# Altium schematic sheet Sheet1.SchDoc
size A; SheetNumber: 1; SheetTotal: 1
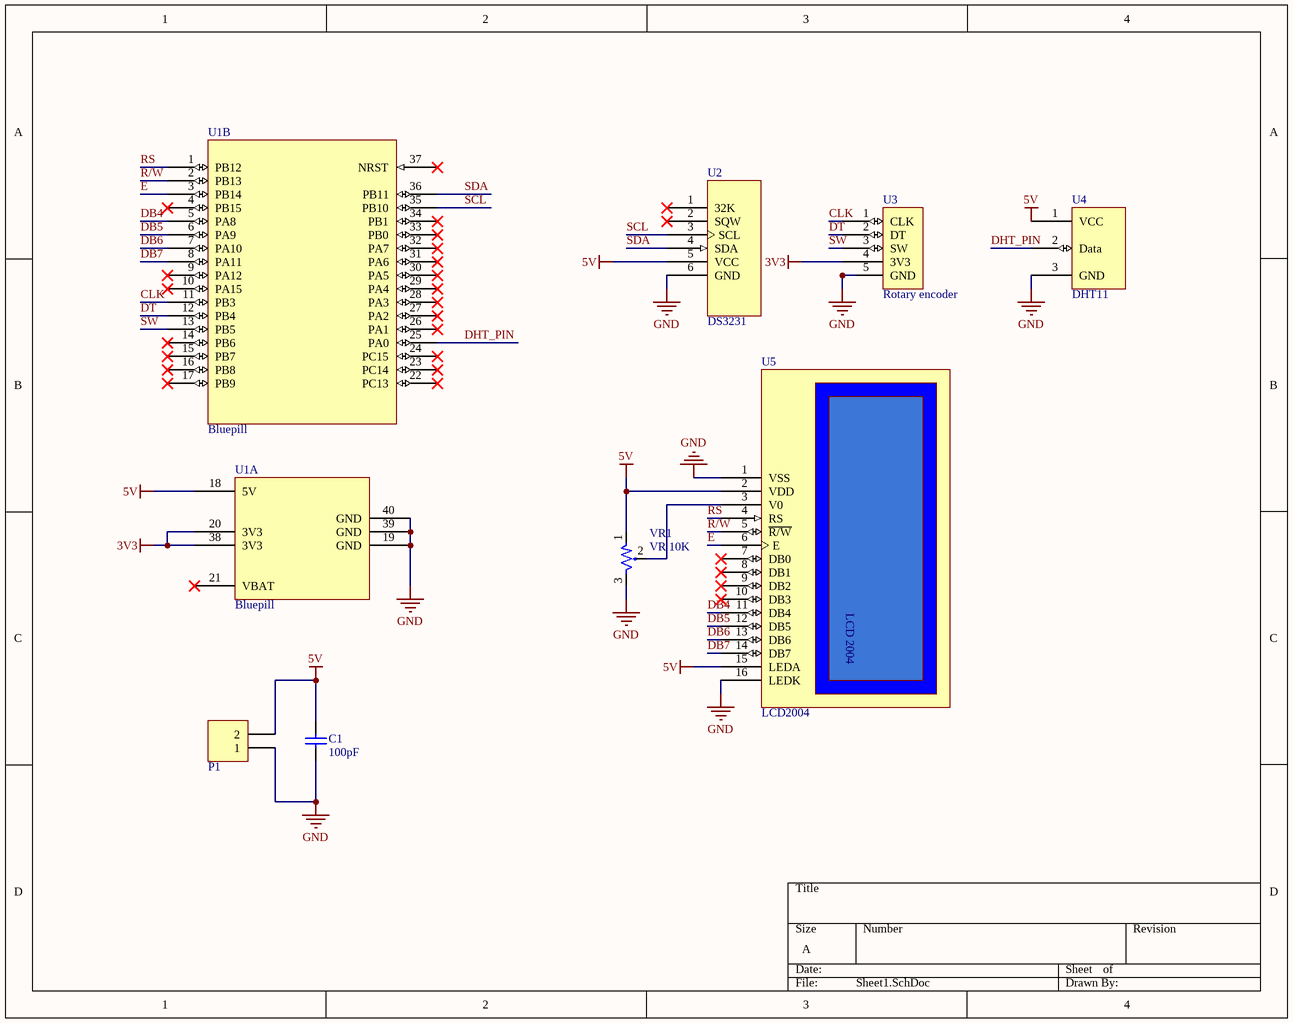
[diagram p0: Sheet1.SchDoc]

## Parts
C1  value 100pF  [CN1]  (hidden comment: Cap Non-Pol)
P1  Domino 2  [DOMINO 2- 5mm]  (value not drawn)
U1  Bluepill  [PCBComponent_1]  (parts A,B of 2)
U2  DS3231  [DS3231]
U3  Rotary encoder  [Rotary Encoder]
U4  DHT11  [DH11]
U5  LCD2004  [LCD2004]
VR1  value VR 10K  [Varistor 1]  (hidden comment: 10K)

## Nets
3V3: U1.20(3V3) U1.38(3V3) U3.4(3V3)
5V: C1.2 P1.2 U1.18(5V) U2.5(VCC) U4.1(VCC) U5.2(VDD) U5.15(LEDA) VR1.1
GND: C1.1 P1.1 U1.19(GND) U1.39(GND) U1.40(GND) U2.6(GND) U3.5(GND) U4.3(GND) U5.1(VSS) U5.16(LEDK) VR1.3
CLK: U1.11(PB3) U3.1(CLK)
DB4: U1.5(PA8) U5.11(DB4)
DB5: U1.6(PA9) U5.12(DB5)
DB6: U1.7(PA10) U5.13(DB6)
DB7: U1.8(PA11) U5.14(DB7)
DHT_PIN: U1.25(PA0) U4.2(Data)
DT: U1.12(PB4) U3.2(DT)
E: U1.3(PB14) U5.6(E)
R/W: U1.2(PB13) U5.5(~{R/W})
RS: U1.1(PB12) U5.4(RS)
SCL: U1.35(PB10) U2.3(SCL)
SDA: U1.36(PB11) U2.4(SDA)
SW: U1.13(PB5) U3.3(SW)
NetU5_3: U5.3(V0) VR1.2

Not connected (* = marked no-connect by the designer): U1 4(PB15)* 9(PA12)* 10(PA15)* 14(PB6)* 15(PB7)* 16(PB8)* 17(PB9)* 21(VBAT)* 22(PC13)* 23(PC14)* 24(PC15)* 26(PA1)* 27(PA2)* 28(PA3)* 29(PA4)* 30(PA5)* 31(PA6)* 32(PA7)* 33(PB0)* 34(PB1)* 37(NRST)*; U2 1(32K)* 2(SQW)*; U5 7(DB0)* 8(DB1)* 9(DB2)* 10(DB3)*

## Notes on the sheet
- (in symbol LCD2004) LCD 2004

## Library data of the parts
C1 = Cap Non-Pol: Capacitor
P1 = Domino 2: Domino, 2-Pin; LatestRevisionDate: 17-Jul-2002; LatestRevisionNote: Re-released for DXP Platform.; Publisher: Altium Limited
U1 = STM32F103C8T6: STM32F103C8T6, mbed-Enabled Development Bluepill STM32F1 ARM® Cortex®-M3 MCU 32-Bit Embedded Evaluation Board; Manufacturer: STMicroelectronics; Packgae/Case: LQFP-48; Speed: 74MHz; Connectivity: CANbus, I²C, IrDA, LINbus, SPI, UART/USART, USB; Peripherals: DMA, Motor Control PWM, PDR, POR, PVD, PWM, Temp Sensor, WDT; Number of I/O: 37; Program Memory Size: 64KB; Program Memory Type: FLASH; RAM Size: 24KB; Voltage - Supply: 2V ~ 3.6V; Product Category: ARM Microcontrollers - MCU; Series: STM32F103C8T6; Mounting Style: SMD/SMT; Core Processor: ARM® Cortex®-M3; Core Size: 32-Bit; Operating Temperature: -40°C ~ 85°C; Mounting Type: Surface Mount; ComponentLink1Description: New link; ComponentLink1URL: *
U5 = LCD2004: Manufacturer: AZ Display; Display Format: 20 x 4; Character Format: 5 x 8 Dots; Display Type: STN - Super-Twisted Nematic, TN - Twisted Nematic; Display Mode: Transmissive; Character Size: 4.75mm H x 2.95mm W; Outline L x W x H: 98.00mm x 60.00mm x 14.00mm; Viewing Area: 76.00mm L x 25.20mm W; Backlight: LED; Voltage - Supply: 2.7V ~ 5.5V; Dot Size: 0.55mm W x 0.55mm H; Package: Box; Operating Temperature: -20°C ~ 70°C; ComponentLink1Description: Datasheet; ComponentLink1URL: https://www.digikey.com/en/products/detail/az-displays/ACM2004G-NLW-BTW/13426757
VR1 = Var Resistor